# Altium project Palme.PrjPcb
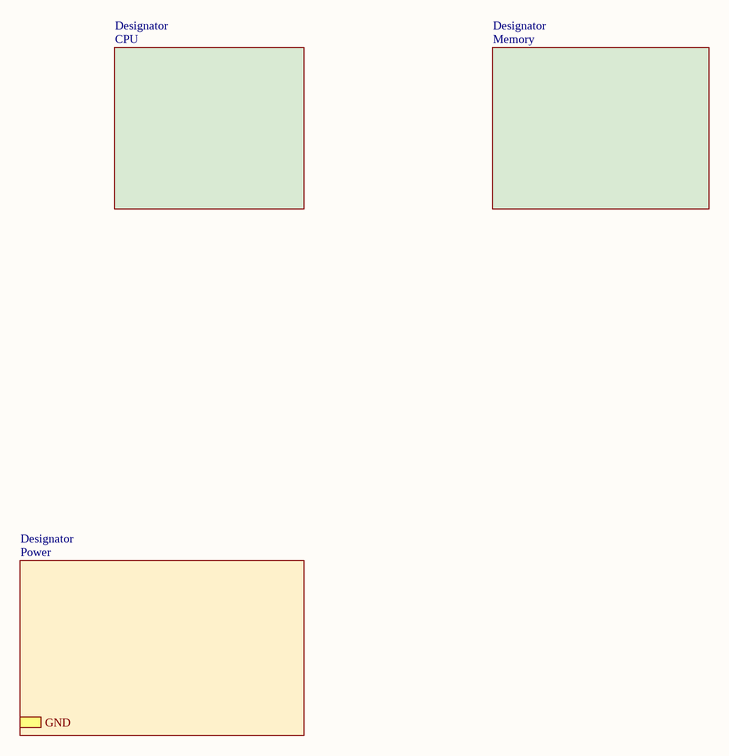
[diagram p0: Top.SchDoc]
4 sheets, 12 parts. Net scope: strictly hierarchical (ports join the sheet entries above them; power ports are local).
Sheets:
  Top.SchDoc
    Designator = CPU.SchDoc
    Designator = Memory.SchDoc
    Designator = Power.SchDoc

## Sheet Top.SchDoc
size A4

### Sub-sheets
Designator = CPU: no entries
Designator = Memory: no entries
Designator = Power: GND

## Sheet CPU.SchDoc
size A3
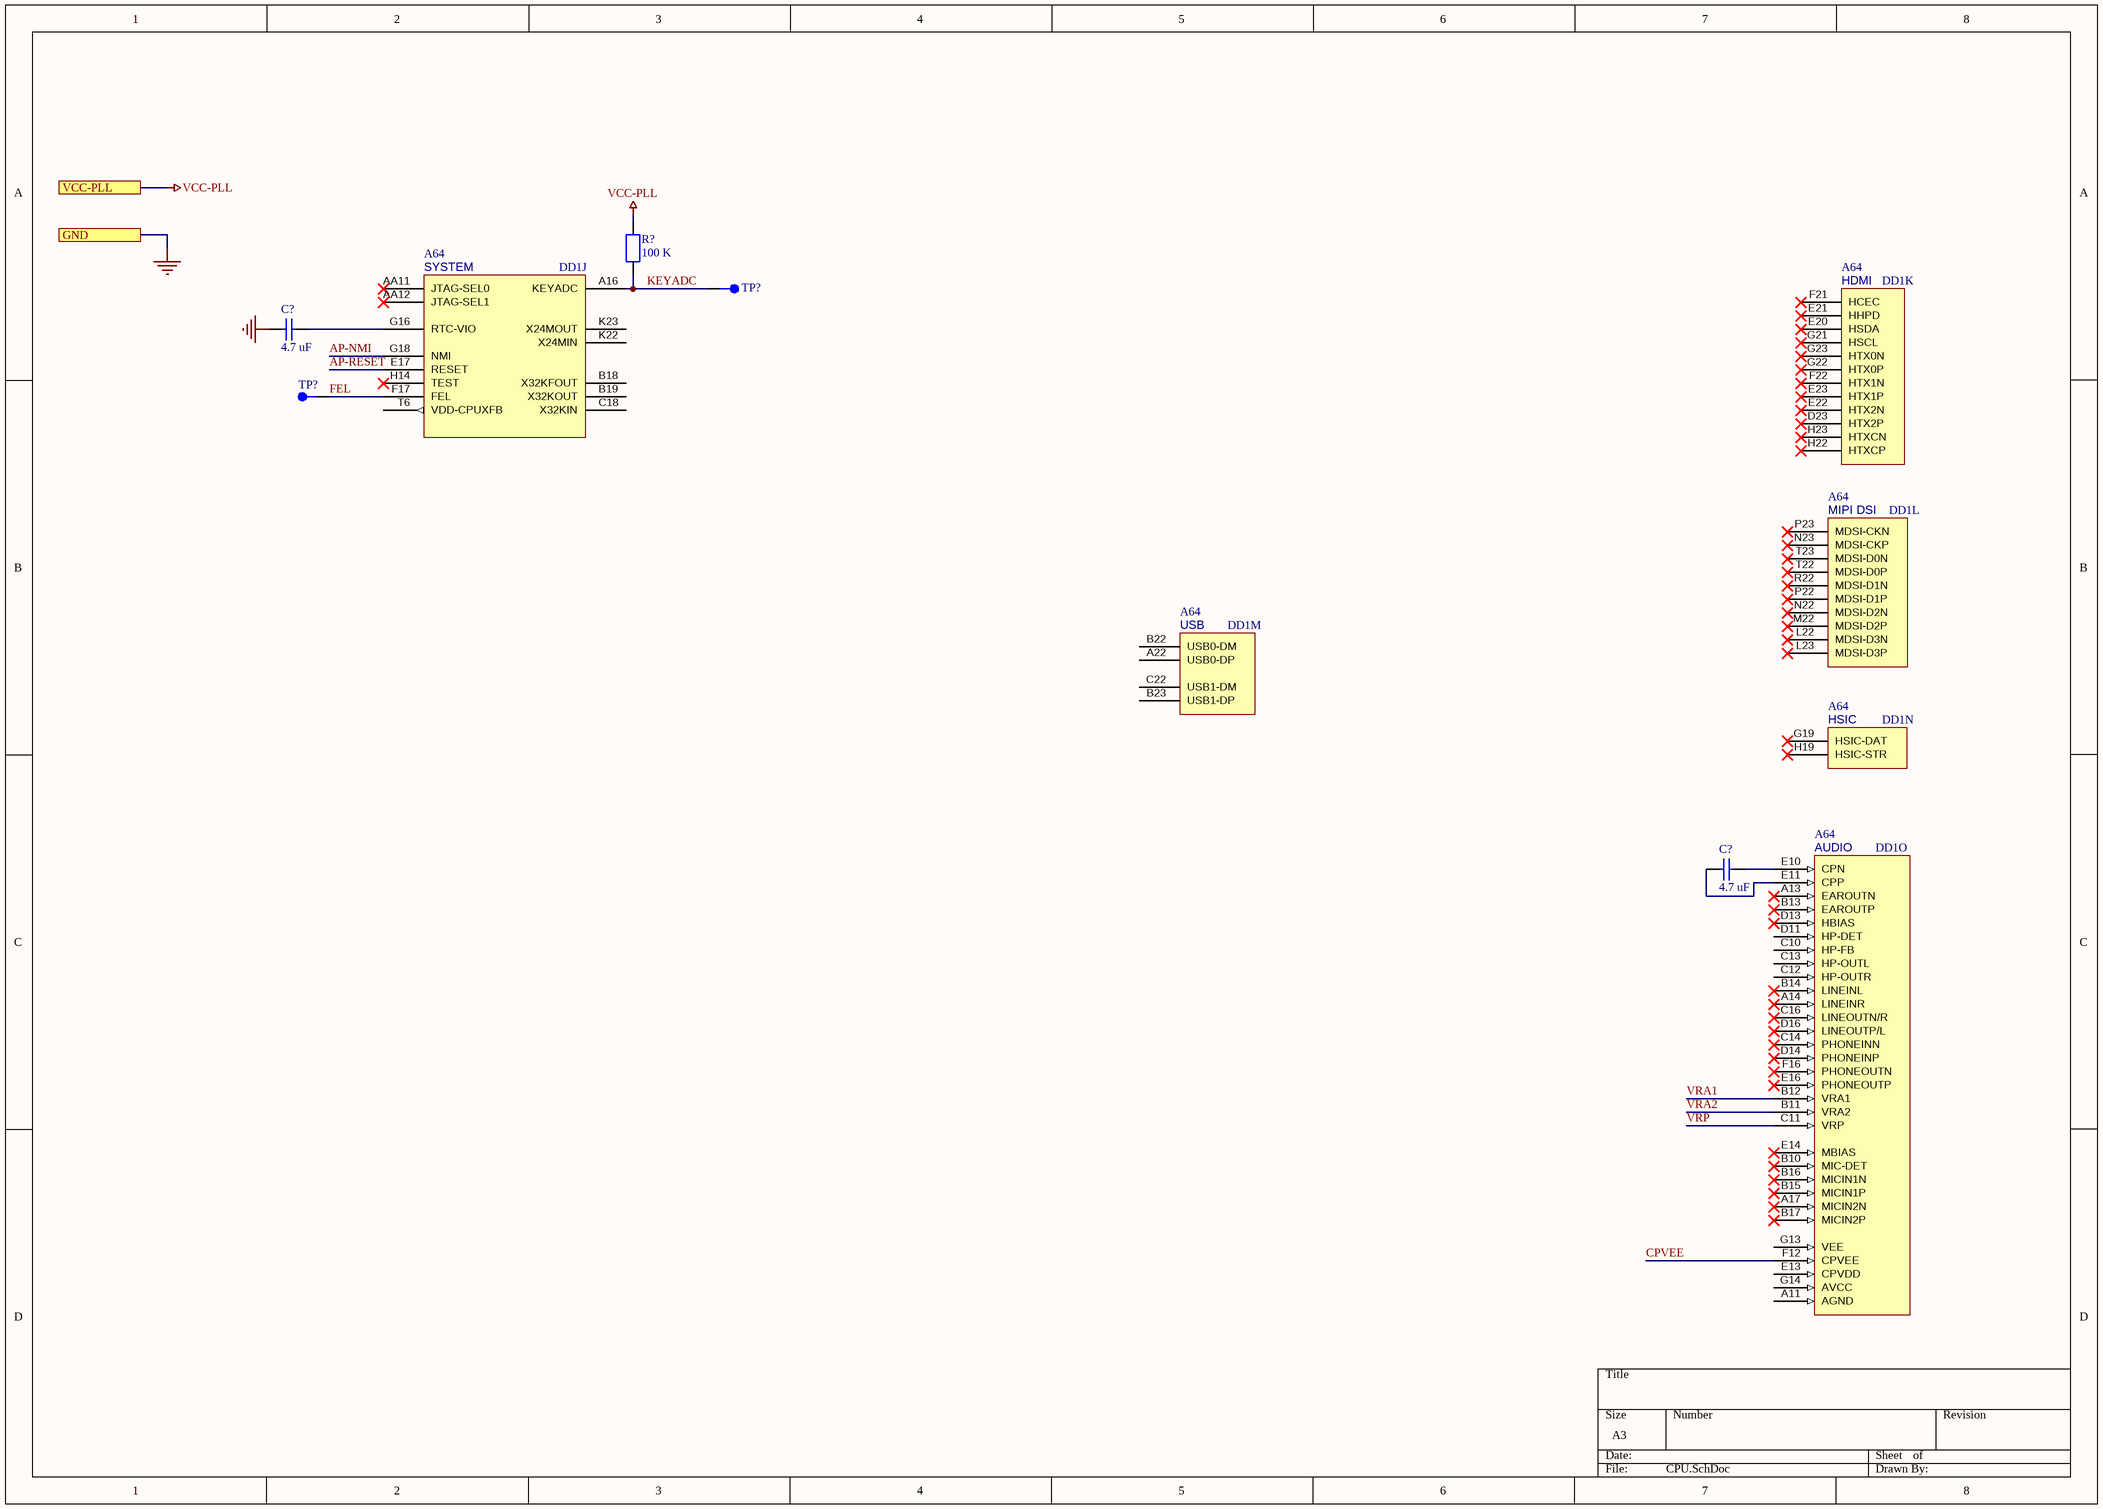
[diagram p1: CPU.SchDoc]

### Parts
(Parts that share a designator on the sheet are numbered #1, #2 ... from top to bottom, then left to right.)
C?#1  4.7 uF  [CAPC1608X80N]
C?#2  4.7 uF  [CAPC1608X80N]
DD1  A64  [BGA396C65P23X23_1500X1500X130]  (parts J,K,L,M,N,O of 16)
R?  100 K  [RESC1005X40N]
TP?#1  (no value)  [TP_ASSY_PAD_13]  (no BOM)
TP?#2  (no value)  [TP_ASSY_PAD_13]  (no BOM)

### Ports
GND, VCC-PLL

### Nets
GND: C?#1.1 ; port GND
VCC-PLL: R?.2 ; port VCC-PLL
AP-NMI: DD1.G18(NMI)
AP-RESET: DD1.E17(RESET)
CPVEE: DD1.F12(CPVEE)
FEL: DD1.F17(FEL) TP?#2.1
KEYADC: DD1.A16(KEYADC) R?.1 TP?#1.1
VRA1: DD1.B12(VRA1)
VRA2: DD1.B11(VRA2)
VRP: DD1.C11(VRP)
NetC?#1_2: C?#1.2 DD1.G16(RTC-VIO)
NetC?#2_1: C?#2.1 DD1.E11(CPP)
NetC?#2_2: C?#2.2 DD1.E10(CPN)

Not connected (* = marked no-connect by the designer): DD1 A11(AGND) A13(EAROUTN)* A14(LINEINR)* A17(MICIN2N)* A22(USB0-DP) AA11(JTAG-SEL0)* AA12(JTAG-SEL1)* B10(MIC-DET)* B13(EAROUTP)* B14(LINEINL)* B15(MICIN1P)* B16(MICIN1N)* B17(MICIN2P)* B18(X32KFOUT) B19(X32KOUT) B22(USB0-DM) B23(USB1-DP) C10(HP-FB) C12(HP-OUTR) C13(HP-OUTL) C14(PHONEINN)* C16(LINEOUTN/R)* C18(X32KIN) C22(USB1-DM) D11(HP-DET) D13(HBIAS)* D14(PHONEINP)* D16(LINEOUTP/L)* D23(HTX2P)* E13(CPVDD) E14(MBIAS)* E16(PHONEOUTP)* E20(HSDA)* E21(HHPD)* E22(HTX2N)* E23(HTX1P)* F16(PHONEOUTN)* F21(HCEC)* F22(HTX1N)* G13(VEE) G14(AVCC) G19(HSIC-DAT)* G21(HSCL)* G22(HTX0P)* G23(HTX0N)* H14(TEST)* H19(HSIC-STR)* H22(HTXCP)* H23(HTXCN)* K22(X24MIN) K23(X24MOUT) L22(MDSI-D3N)* L23(MDSI-D3P)* M22(MDSI-D2P)* N22(MDSI-D2N)* N23(MDSI-CKP)* P22(MDSI-D1P)* P23(MDSI-CKN)* R22(MDSI-D1N)* T6(VDD-CPUXFB) T22(MDSI-D0P)* T23(MDSI-D0N)*

### Notes on the sheet
- (in symbol A64, part J) SYSTEM
- (in symbol A64, part K) HDMI
- (in symbol A64, part L) MIPI DSI
- (in symbol A64, part M) USB
- (in symbol A64, part N) HSIC
- (in symbol A64, part O) AUDIO

### Library data of the parts
C?#1 C?#2 = CAP-0044: CAP CER 4.7UF 16V X5R 0603; Manufacturer: Yageo; Manufacturer Part Number: CC0603KRX5R7BB475; Tolerance: ±10%; Type: Capacitors; Unique Id: CAP-0044; Voltage: 16 V; Author: Derstuganov; Case: 0603; Category: MLCC; ComponentLink1Description: Datasheet; ComponentLink1URL: https://www.yageo.com/upload/media/product/productsearch/datasheet/mlcc/UPY-GPHC_X5R_4V-to-50V_25.pdf; TC: X5R; Temperature: -55°C to 85°C; Termination style: SMD; Value: 4.7 uF; Status: Draft
DD1 = A64: 4xA53
R? = RES-0019: RES SMD 100K OHM 1% 1/16W 0402; Manufacturer: Yageo; Manufacturer Part Number: RC0402FR-07100KL; TC: ±100ppm/°C; Power: 0.063 W; Unique Id: RES-0019; Author: Laptev; Case: 0402; Category: Film; ComponentLink1Description: Datasheet; ComponentLink1URL: https://www.yageo.com/upload/media/product/productsearch/datasheet/rchip/PYu-RC_Group_51_RoHS_L_10.pdf; Temperature: -55°C to 155°C; Termination style: SMD; Tolerance: ±1%; Value: 100 K; Status: Draft; Type: Resistors
TP?#1 TP?#2 = EM-0002: Assembly Testpoint PAD 1.3mm; Unique Id: EM-0002; Author: Laptev; Case: SMD-1; Category: Testpoint; Termination style: SMD; Status: Draft; Type: Electro Mechanicals

## Sheet Memory.SchDoc
size A4

## Sheet Power.SchDoc
size A2
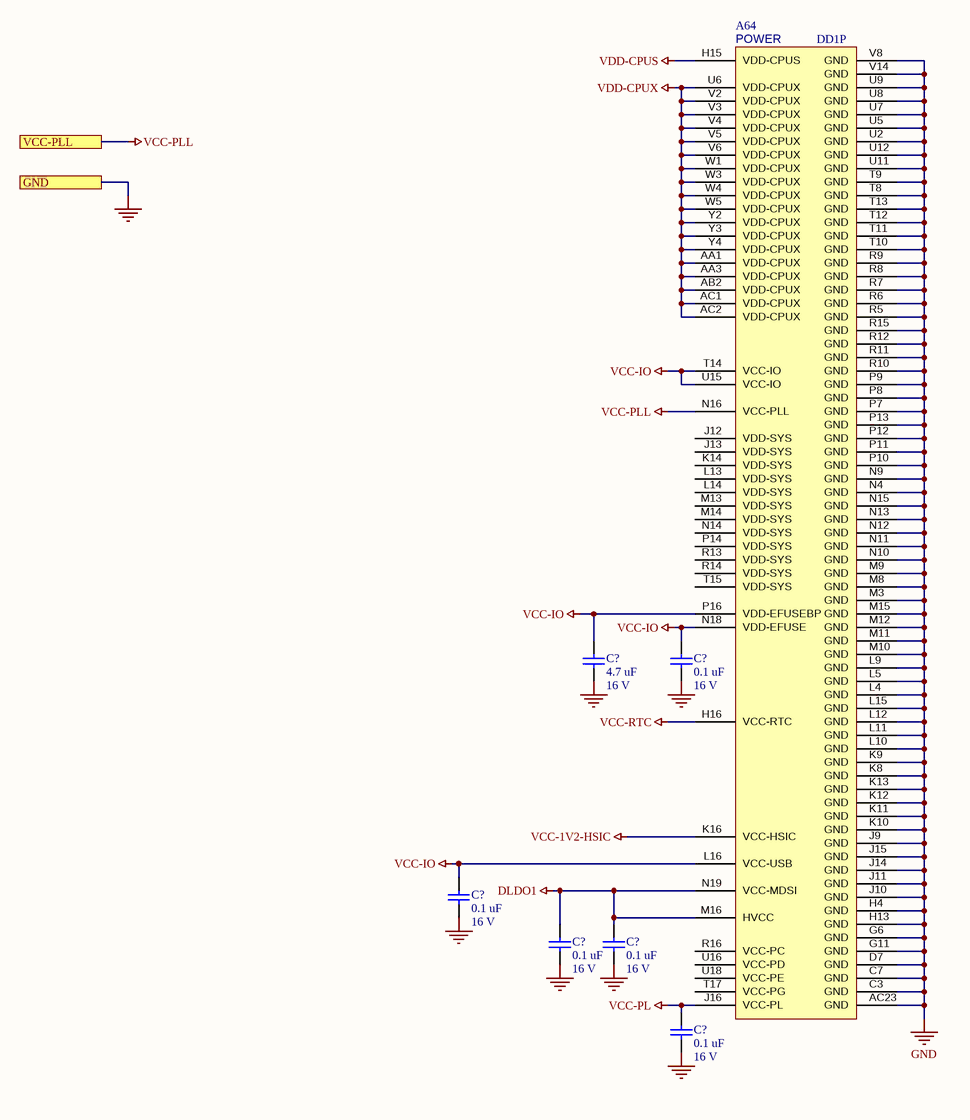
[diagram p2: Power.SchDoc]

### Parts
(Parts that share a designator on the sheet are numbered #1, #2 ... from top to bottom, then left to right.)
C?#3  4.7 uF  Voltage: 16 V  [CAPC1608X80N]
C?#4  0.1 uF  Voltage: 16 V  [CAPC1005X55N]
C?#5  0.1 uF  Voltage: 16 V  [CAPC1005X55N]
C?#6  0.1 uF  Voltage: 16 V  [CAPC1005X55N]
C?#7  0.1 uF  Voltage: 16 V  [CAPC1005X55N]
C?#8  0.1 uF  Voltage: 16 V  [CAPC1005X55N]
DD1  A64  [BGA396C65P23X23_1500X1500X130]  (part P of 16)

### Ports
GND, VCC-PLL

### Nets
DLDO1: C?#6.2 C?#7.2 DD1.M16(HVCC) DD1.N19(VCC-MDSI)
GND: C?#3.1 C?#4.1 C?#5.1 C?#6.1 C?#7.1 C?#8.1 DD1.AC23(GND) DD1.C3(GND) DD1.C7(GND) DD1.D7(GND) DD1.G6(GND) DD1.G11(GND) DD1.H4(GND) DD1.H13(GND) DD1.J9(GND) DD1.J10(GND) DD1.J11(GND) DD1.J14(GND) DD1.J15(GND) DD1.K8(GND) DD1.K9(GND) DD1.K10(GND) DD1.K11(GND) DD1.K12(GND) DD1.K13(GND) DD1.L4(GND) DD1.L5(GND) DD1.L9(GND) DD1.L10(GND) DD1.L11(GND) DD1.L12(GND) DD1.L15(GND) DD1.M3(GND) DD1.M8(GND) DD1.M9(GND) DD1.M10(GND) DD1.M11(GND) DD1.M12(GND) DD1.M15(GND) DD1.N4(GND) DD1.N9(GND) DD1.N10(GND) DD1.N11(GND) DD1.N12(GND) DD1.N13(GND) DD1.N15(GND) DD1.P7(GND) DD1.P8(GND) DD1.P9(GND) DD1.P10(GND) DD1.P11(GND) DD1.P12(GND) DD1.P13(GND) DD1.R5(GND) DD1.R6(GND) DD1.R7(GND) DD1.R8(GND) DD1.R9(GND) DD1.R10(GND) DD1.R11(GND) DD1.R12(GND) DD1.R15(GND) DD1.T8(GND) DD1.T9(GND) DD1.T10(GND) DD1.T11(GND) DD1.T12(GND) DD1.T13(GND) DD1.U2(GND) DD1.U5(GND) DD1.U7(GND) DD1.U8(GND) DD1.U9(GND) DD1.U11(GND) DD1.U12(GND) DD1.V8(GND) DD1.V14(GND) ; port GND
VCC-1V2-HSIC: DD1.K16(VCC-HSIC)
VCC-IO: C?#3.2 C?#4.2 C?#5.2 DD1.L16(VCC-USB) DD1.N18(VDD-EFUSE) DD1.P16(VDD-EFUSEBP) DD1.T14(VCC-IO) DD1.U15(VCC-IO)
VCC-PL: C?#8.2 DD1.J16(VCC-PL)
VCC-PLL: DD1.N16(VCC-PLL) ; port VCC-PLL
VCC-RTC: DD1.H16(VCC-RTC)
VDD-CPUS: DD1.H15(VDD-CPUS)
VDD-CPUX: DD1.AA1(VDD-CPUX) DD1.AA3(VDD-CPUX) DD1.AB2(VDD-CPUX) DD1.AC1(VDD-CPUX) DD1.AC2(VDD-CPUX) DD1.U6(VDD-CPUX) DD1.V2(VDD-CPUX) DD1.V3(VDD-CPUX) DD1.V4(VDD-CPUX) DD1.V5(VDD-CPUX) DD1.V6(VDD-CPUX) DD1.W1(VDD-CPUX) DD1.W3(VDD-CPUX) DD1.W4(VDD-CPUX) DD1.W5(VDD-CPUX) DD1.Y2(VDD-CPUX) DD1.Y3(VDD-CPUX) DD1.Y4(VDD-CPUX)

Not connected (* = marked no-connect by the designer): DD1 J12(VDD-SYS) J13(VDD-SYS) K14(VDD-SYS) L13(VDD-SYS) L14(VDD-SYS) M13(VDD-SYS) M14(VDD-SYS) N14(VDD-SYS) P14(VDD-SYS) R13(VDD-SYS) R14(VDD-SYS) R16(VCC-PC) T15(VDD-SYS) T17(VCC-PG) U16(VCC-PD) U18(VCC-PE)

### Notes on the sheet
- (in symbol A64, part P) POWER

### Library data of the parts
C?#3 = CAP-0044: as C?#1 on sheet CPU; Unique Id: CAP-0044; Author: Derstuganov; Case: 0603; Category: MLCC; ComponentLink1Description: Datasheet; ComponentLink1URL: https://www.yageo.com/upload/media/product/productsearch/datasheet/mlcc/UPY-GPHC_X5R_4V-to-50V_25.pdf; TC: X5R; Temperature: -55°C to 85°C; Termination style: SMD; Value: 4.7 uF; Status: Draft
C?#4-C?#8 = CAP-0035: CAP CER 0.1UF 16V X7R 0402; Manufacturer: Murata; Manufacturer Part Number: GCM155R71C104KA55J; Tolerance: ±10%; Type: Capacitors; Unique Id: CAP-0035; Author: Derstuganov; Case: 0402; Category: MLCC; ComponentLink1Description: Datasheet; ComponentLink1URL: https://search.murata.co.jp/Ceramy/image/img/A01X/G101/ENG/GRM155R71E104KE14-01.pdf; TC: X7R; Temperature: -55℃ to 125℃; Termination style: SMD; Value: 0.1 uF; Status: Draft
DD1 = A64: 4xA53